# EAGLE board ESP32_Thing_Plus (EAGLE 9.3.1), part 1 of 2
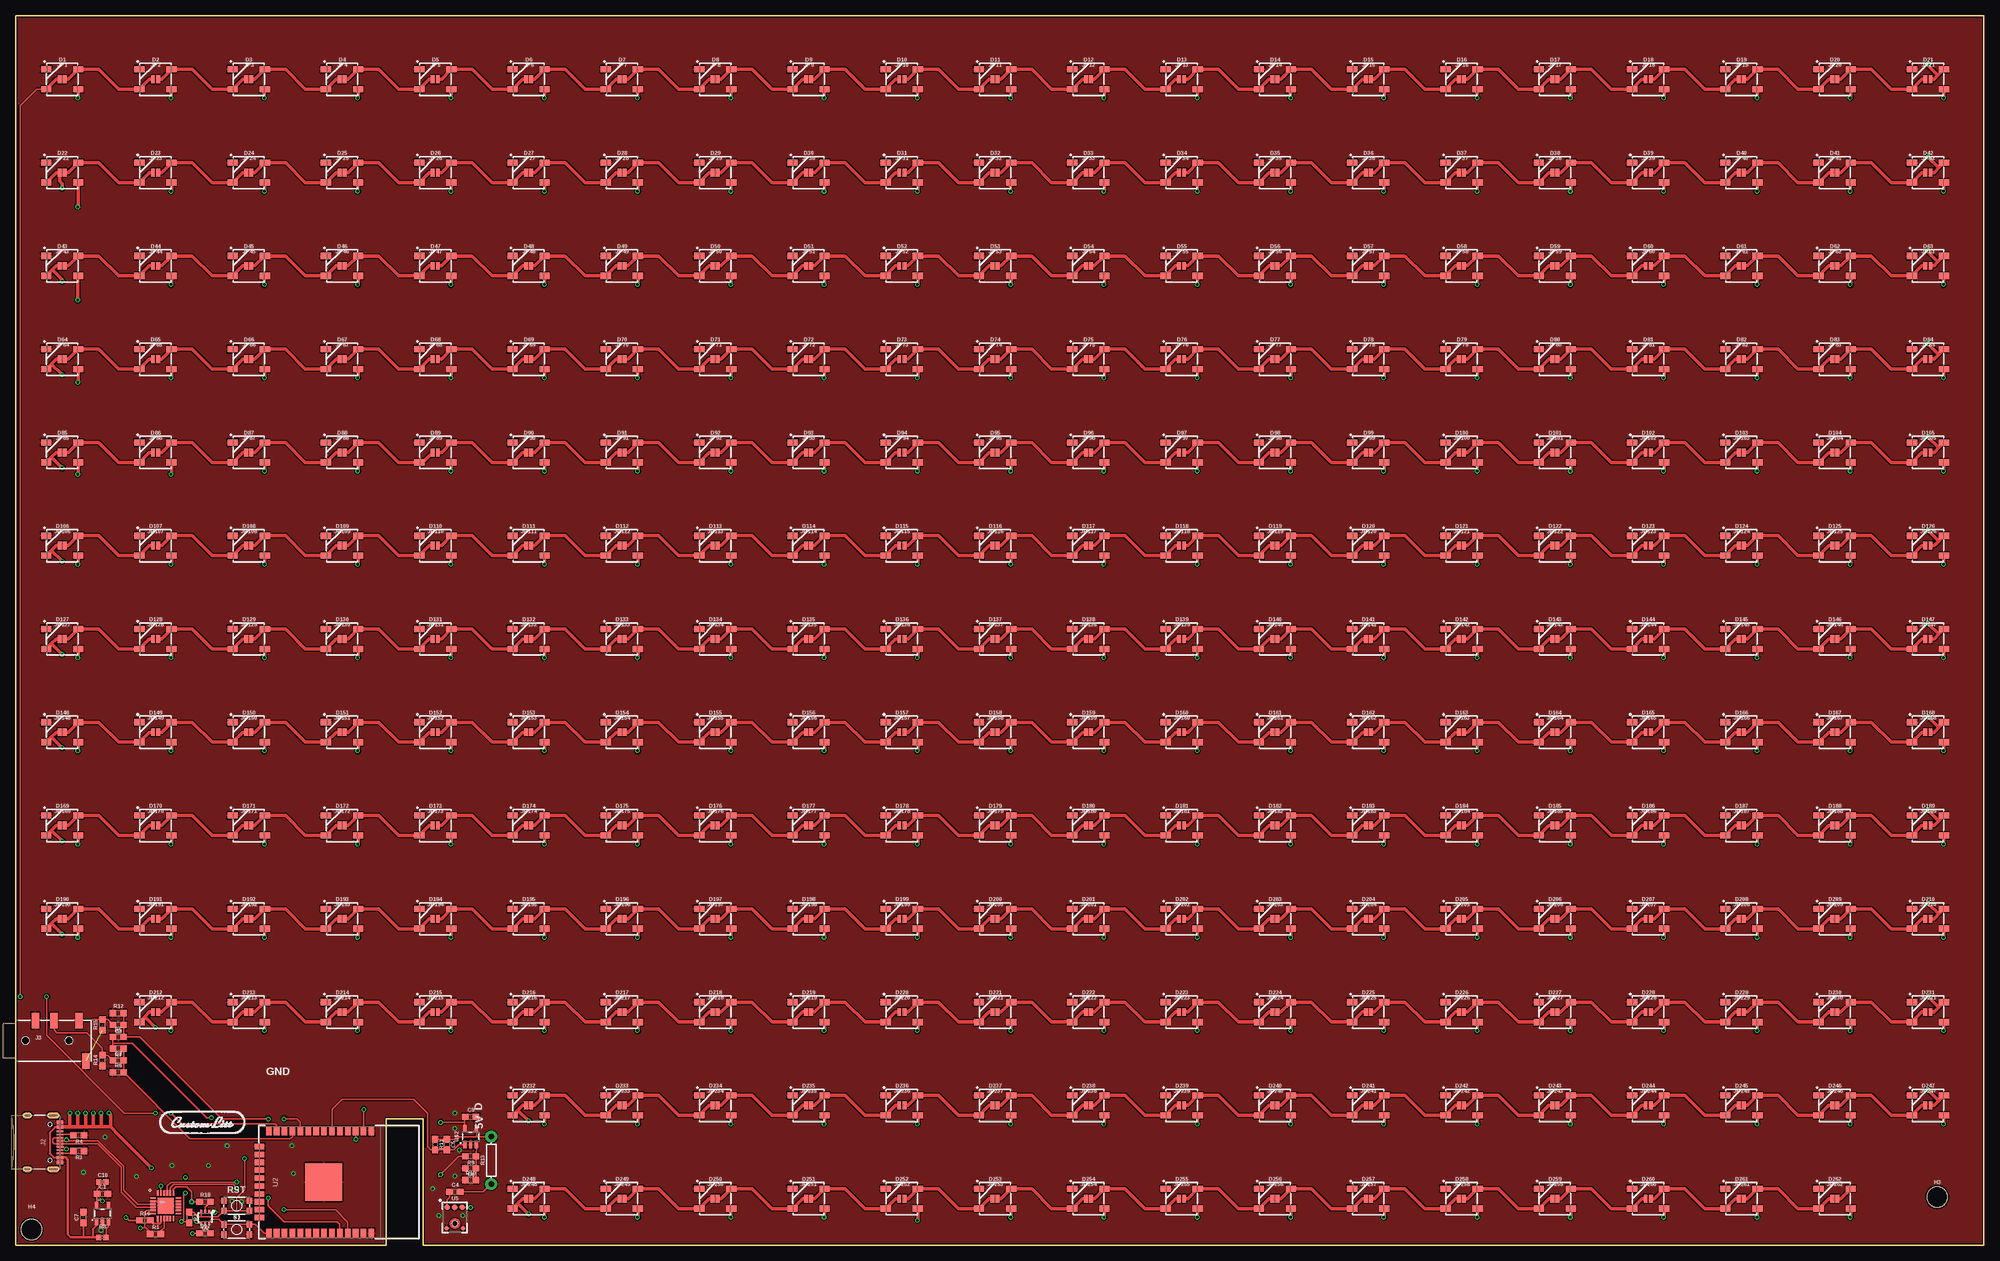
[diagram p4: board, top side]
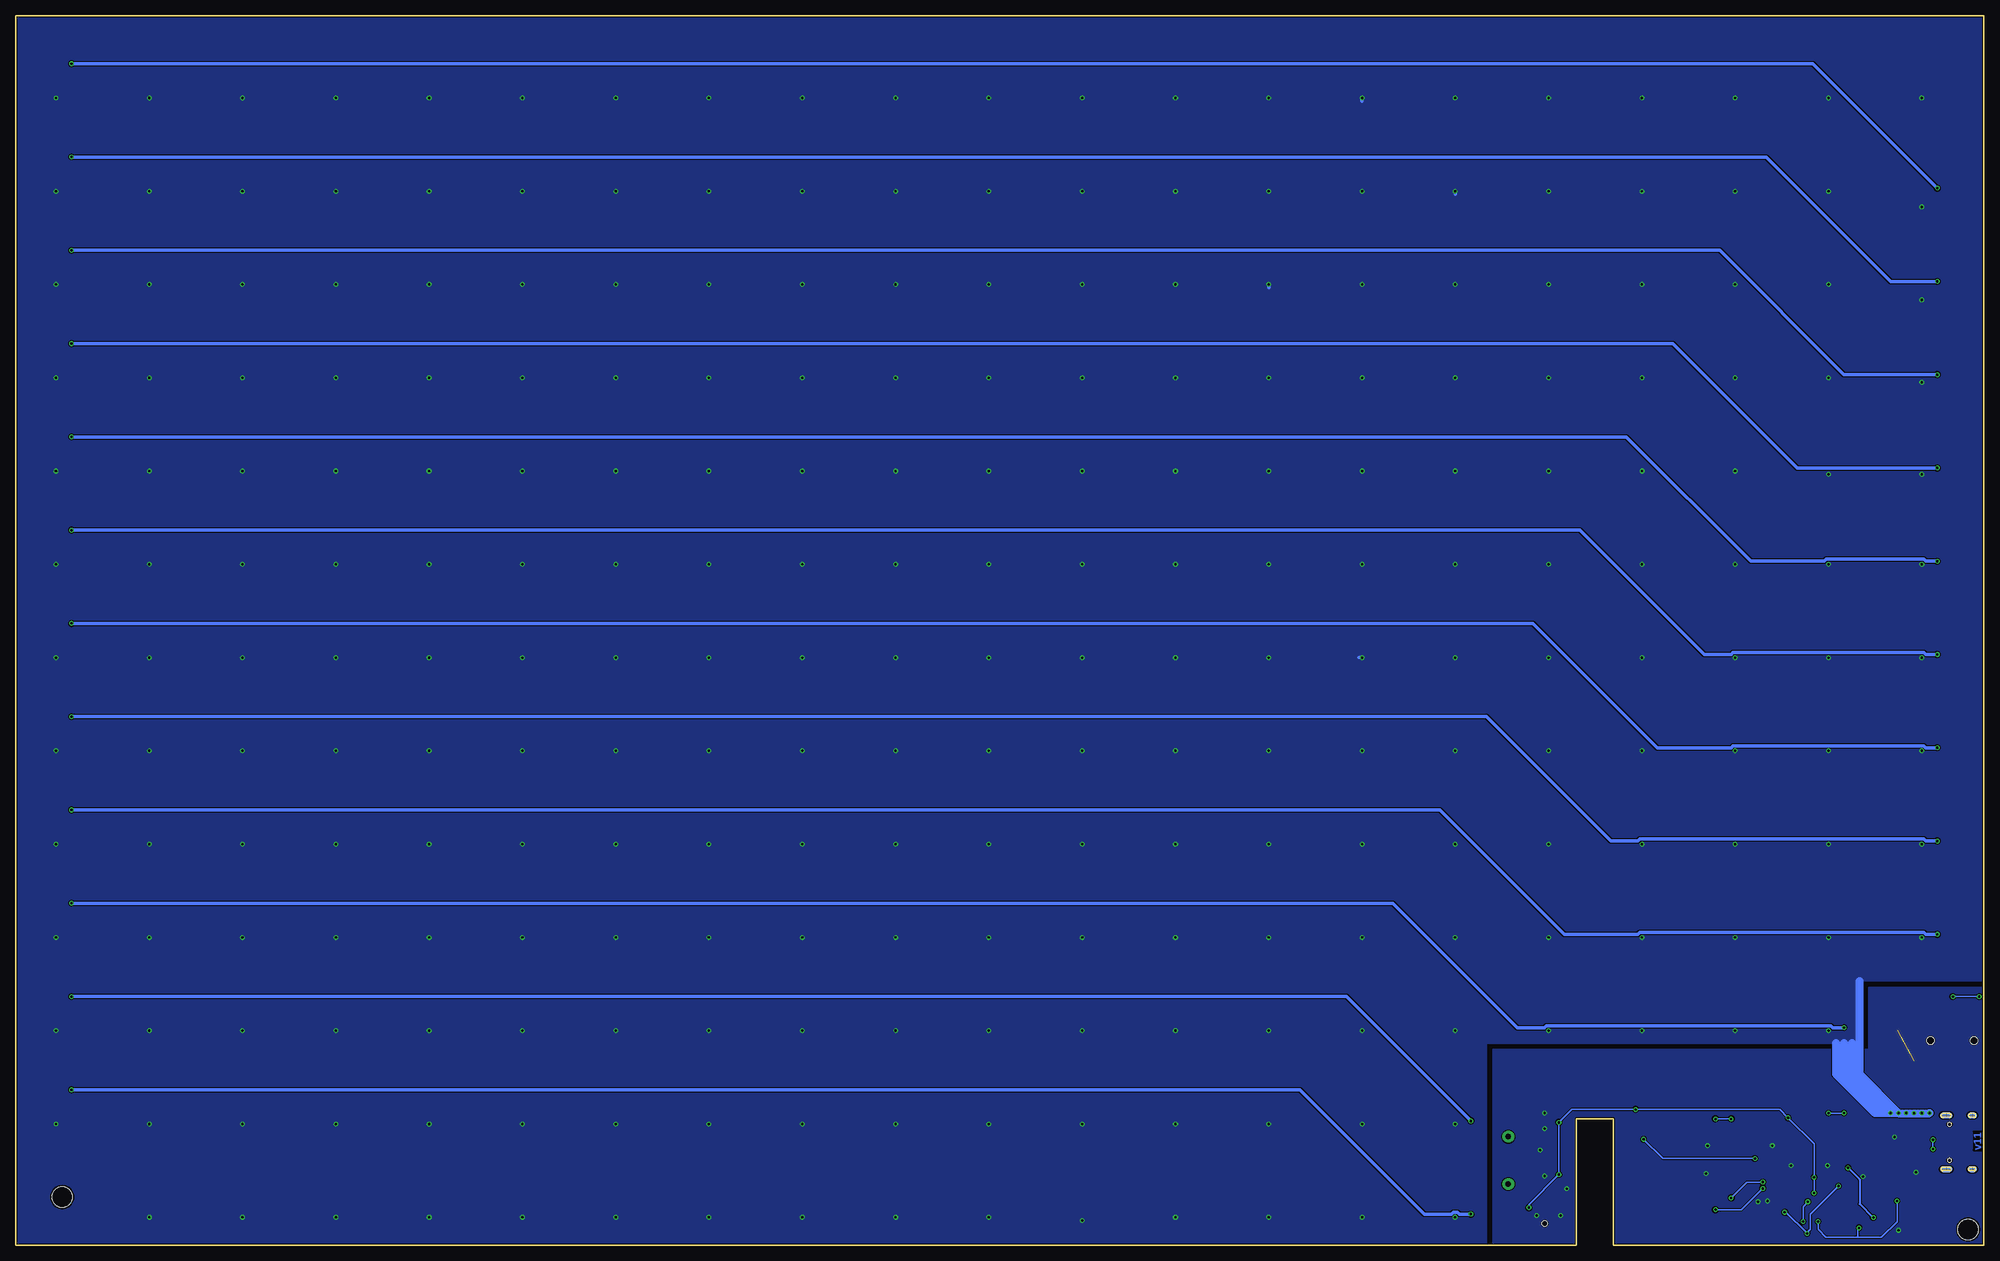
[diagram p5: board, bottom side, seen from below]

Size 316.5 x 197.75 mm. Coordinates in mm from the lower left corner, seen from the top.
Outline: 316.5,0 316.5,197.75 0,197.75 0,0 59.56,0 59.56,20.32 65.53,20.32 65.53,0 316.5,0
Copper layers (1*16): Top 0.035mm / dielectric 1.5mm / Bottom 0.035mm
Design rules "SparkFun-2-layer-TIGHT *": minimum track width 7mil, minimum drill 15mil, track to track 7mil, track to pad 7mil, pad to pad 7mil, via to via 7mil, smd to smd 7mil, copper to edge 7mil, drill to drill 7mil, minimum pad ring 7mil, minimum via ring 7mil, stop-mask expansion 4mil, vias tented up to drill 25mil, thermal gap 10mil

## Footprints (pad centres in the part's own frame; a part is rotated, then mirrored left to right if it is on the bottom)
0603 = smd 1.1 x 1: 1 -0.85,0; 2 0.85,0
0402 = smd 0.85 x 0.9: 1 -0.58,0; 2 0.58,0
WS2812B = smd 1.651 x 1: 1 2.577,-1.6; 2 2.577,1.6; 3 -2.577,1.6; 4 -2.577,-1.6
FIDUCIAL-MICRO = smd 0.635 x 0.635: 1 0,0
STAND-OFF = hole 3.302: 0,0
USB-C-16P = smd 0.3 x 1.016: A5 -1.25,0.154; A6 -0.25,0.154; A7 0.25,0.154; A8 1.25,0.154; B5 1.75,0.154; B6 0.75,0.154; B7 -0.75,0.154; B8 -1.75,0.154 | smd 0.6 x 1.016: GND -3.225,0.154; GND2 3.225,0.154 | smd 1 x 2.1: SHLD1 -4.32,-0.915; SHLD2 4.32,-0.915 | smd 1 x 2.1 bottom: SHLD3 -4.32,-0.915; SHLD4 4.32,-0.915 | smd 1 x 1.6: SHLD5 -4.32,-5.095; SHLD8 4.32,-5.095 | smd 1 x 1.6 bottom: SHLD6 -4.32,-5.095; SHLD7 4.32,-5.095 | smd 0.55 x 1.016: VBUS1 -2.45,0.154; VBUS2 2.45,0.154 | hole 0.65: -2.89,-1.445; 2.89,-1.445
AUDIO_JACK_3.5MM_TRRS_SMD_RA = smd 1.2 x 2.5: EARTH 11.3,-3.25; RING1 6.2,3.25; RING2 3.2,3.25; TIP 10.2,3.25 | hole 1.2: 1.6,0; 8.6,0
SMT-JUMPER_2_NO_NO-SILK = smd 0.635 x 1.27: 1 -0.406,0; 2 0.406,0
SC70-6 = smd 0.3 x 0.66: 1 -0.65,-0.92; 2 0,-0.92; 3 0.65,-0.92; 4 0.65,0.92; 5 0,0.92; 6 -0.65,0.92
AXIAL-0.3 = drill 0.9 pad 1.88: P$1 -3.81,0; P$2 3.81,0
TACTILE_SWITCH_SMD_4.6X2.8MM = smd 0.9 x 1: 1 -2.05,-0.8; 2 2.05,-0.8; 3 2.05,0.8; 4 -2.05,0.8
ESP-WROOM-32-NARROW = smd 0.9 x 1.5: 1 6.43,8.238; 2 5.16,8.238; 3 3.89,8.238; 4 2.62,8.238; 5 1.35,8.238; 6 0.08,8.238; 7 -1.19,8.238; 8 -2.46,8.238; 9 -3.73,8.238; 10 -5,8.238; 11 -6.27,8.238; 12 -7.54,8.238; 13 -8.81,8.238; 14 -10.08,8.238; 25 -10.08,-8.238; 26 -8.81,-8.238; 27 -7.54,-8.238; 28 -6.27,-8.238; 29 -5,-8.238; 30 -3.73,-8.238; 31 -2.46,-8.238; 32 -1.19,-8.238; 33 0.08,-8.238; 34 1.35,-8.238; 35 2.62,-8.238; 36 3.89,-8.238; 37 5.16,-8.238; 38 6.43,-8.238 | smd 1.5 x 0.9: 15 -11.57,5.715; 16 -11.57,4.445; 17 -11.57,3.175; 18 -11.57,1.905; 19 -11.57,0.635; 20 -11.57,-0.635; 21 -11.57,-1.905; 22 -11.57,-3.175; 23 -11.57,-4.445; 24 -11.57,-5.715 | smd 6 x 6: GND -1.27,0
SOT23-5 = smd 0.55 x 1.2: 1 -0.95,-1.3; 2 0,-1.3; 3 0.95,-1.3; 4 0.95,1.3; 5 -0.95,1.3
QFN24 = smd 0.85 x 0.3: 1 -2.05,1.25; 2 -2.05,0.75; 3 -2.05,0.25; 4 -2.05,-0.25; 5 -2.05,-0.75; 6 -2.05,-1.25; 13 2.05,-1.25; 14 2.05,-0.75; 15 2.05,-0.25; 16 2.05,0.25; 17 2.05,0.75; 18 2.05,1.25 | smd 0.3 x 0.85: 7 -1.25,-2.05; 8 -0.75,-2.05; 9 -0.25,-2.05; 10 0.25,-2.05; 11 0.75,-2.05; 12 1.25,-2.05; 19 1.25,2.05; 20 0.75,2.05; 21 0.25,2.05; 22 -0.25,2.05; 23 -0.75,2.05; 24 -1.25,2.05 | smd 2.55 x 2.55: PAD 0,0
ADMP401 = smd 0.9 x 0.9: 1 -1.2,2.62; 5 1.2,2.62; 6 0,2.62 | smd 0.7 x 0.7: 2 1.3,-0.8; 4 -1.3,-0.8 | hole 0.9: 0,0

## Placement (x,y rotation side)
C1  10uF  [0603]  13.97,8.26 0 top
C2  0.1uF  [0603]  16.51,29.73 0 top
C3  0.1uF  [0603]  16.51,35.44 180 top
C4  4.7uF  [0603]  70.63,8.58 0 top
C5  100pF  [0603]  69.36,16.2 270 top
C6  1.0uF  [0603]  73.17,12.39 180 top
C7  1.0uF  [0603]  10.92,4.45 90 top
C9  0.1uF  [0603]  73.17,20.64 0 top
C10  1.0uF  [0402]  13.97,10.16 0 top
D1  WS2812B  [WS2812B]  7.5,187.5 0 top
D2  WS2812B  [WS2812B]  22.5,187.5 0 top
D3  WS2812B  [WS2812B]  37.5,187.5 0 top
D4  WS2812B  [WS2812B]  52.5,187.5 0 top
D5  WS2812B  [WS2812B]  67.5,187.5 0 top
D6  WS2812B  [WS2812B]  82.5,187.5 0 top
D7  WS2812B  [WS2812B]  97.5,187.5 0 top
D8  WS2812B  [WS2812B]  112.5,187.5 0 top
D9  WS2812B  [WS2812B]  127.5,187.5 0 top
D10  WS2812B  [WS2812B]  142.5,187.5 0 top
D11  WS2812B  [WS2812B]  157.5,187.5 0 top
D12  WS2812B  [WS2812B]  172.5,187.5 0 top
D13  WS2812B  [WS2812B]  187.5,187.5 0 top
D14  WS2812B  [WS2812B]  202.5,187.5 0 top
D15  WS2812B  [WS2812B]  217.5,187.5 0 top
D16  WS2812B  [WS2812B]  232.5,187.5 0 top
D17  WS2812B  [WS2812B]  247.5,187.5 0 top
D18  WS2812B  [WS2812B]  262.5,187.5 0 top
D19  WS2812B  [WS2812B]  277.5,187.5 0 top
D20  WS2812B  [WS2812B]  292.5,187.5 0 top
D21  WS2812B  [WS2812B]  307.5,187.5 0 top
D22  WS2812B  [WS2812B]  7.5,172.5 0 top
D23  WS2812B  [WS2812B]  22.5,172.5 0 top
D24  WS2812B  [WS2812B]  37.5,172.5 0 top
D25  WS2812B  [WS2812B]  52.5,172.5 0 top
D26  WS2812B  [WS2812B]  67.5,172.5 0 top
D27  WS2812B  [WS2812B]  82.5,172.5 0 top
D28  WS2812B  [WS2812B]  97.5,172.5 0 top
D29  WS2812B  [WS2812B]  112.5,172.5 0 top
D30  WS2812B  [WS2812B]  127.5,172.5 0 top
D31  WS2812B  [WS2812B]  142.5,172.5 0 top
D32  WS2812B  [WS2812B]  157.5,172.5 0 top
D33  WS2812B  [WS2812B]  172.5,172.5 0 top
D34  WS2812B  [WS2812B]  187.5,172.5 0 top
D35  WS2812B  [WS2812B]  202.5,172.5 0 top
D36  WS2812B  [WS2812B]  217.5,172.5 0 top
D37  WS2812B  [WS2812B]  232.5,172.5 0 top
D38  WS2812B  [WS2812B]  247.5,172.5 0 top
D39  WS2812B  [WS2812B]  262.5,172.5 0 top
D40  WS2812B  [WS2812B]  277.5,172.5 0 top
D41  WS2812B  [WS2812B]  292.5,172.5 0 top
D42  WS2812B  [WS2812B]  307.5,172.5 0 top
D43  WS2812B  [WS2812B]  7.5,157.5 0 top
D44  WS2812B  [WS2812B]  22.5,157.5 0 top
D45  WS2812B  [WS2812B]  37.5,157.5 0 top
D46  WS2812B  [WS2812B]  52.5,157.5 0 top
D47  WS2812B  [WS2812B]  67.5,157.5 0 top
D48  WS2812B  [WS2812B]  82.5,157.5 0 top
D49  WS2812B  [WS2812B]  97.5,157.5 0 top
D50  WS2812B  [WS2812B]  112.5,157.5 0 top
D51  WS2812B  [WS2812B]  127.5,157.5 0 top
D52  WS2812B  [WS2812B]  142.5,157.5 0 top
D53  WS2812B  [WS2812B]  157.5,157.5 0 top
D54  WS2812B  [WS2812B]  172.5,157.5 0 top
D55  WS2812B  [WS2812B]  187.5,157.5 0 top
D56  WS2812B  [WS2812B]  202.5,157.5 0 top
D57  WS2812B  [WS2812B]  217.5,157.5 0 top
D58  WS2812B  [WS2812B]  232.5,157.5 0 top
D59  WS2812B  [WS2812B]  247.5,157.5 0 top
D60  WS2812B  [WS2812B]  262.5,157.5 0 top
D61  WS2812B  [WS2812B]  277.5,157.5 0 top
D62  WS2812B  [WS2812B]  292.5,157.5 0 top
D63  WS2812B  [WS2812B]  307.5,157.5 0 top
D64  WS2812B  [WS2812B]  7.5,142.5 0 top
D65  WS2812B  [WS2812B]  22.5,142.5 0 top
D66  WS2812B  [WS2812B]  37.5,142.5 0 top
D67  WS2812B  [WS2812B]  52.5,142.5 0 top
D68  WS2812B  [WS2812B]  67.5,142.5 0 top
D69  WS2812B  [WS2812B]  82.5,142.5 0 top
D70  WS2812B  [WS2812B]  97.5,142.5 0 top
D71  WS2812B  [WS2812B]  112.5,142.5 0 top
D72  WS2812B  [WS2812B]  127.5,142.5 0 top
D73  WS2812B  [WS2812B]  142.5,142.5 0 top
D74  WS2812B  [WS2812B]  157.5,142.5 0 top
D75  WS2812B  [WS2812B]  172.5,142.5 0 top
D76  WS2812B  [WS2812B]  187.5,142.5 0 top
D77  WS2812B  [WS2812B]  202.5,142.5 0 top
D78  WS2812B  [WS2812B]  217.5,142.5 0 top
D79  WS2812B  [WS2812B]  232.5,142.5 0 top
D80  WS2812B  [WS2812B]  247.5,142.5 0 top
D81  WS2812B  [WS2812B]  262.5,142.5 0 top
D82  WS2812B  [WS2812B]  277.5,142.5 0 top
D83  WS2812B  [WS2812B]  292.5,142.5 0 top
D84  WS2812B  [WS2812B]  307.5,142.5 0 top
D85  WS2812B  [WS2812B]  7.5,127.5 0 top
D86  WS2812B  [WS2812B]  22.5,127.5 0 top
D87  WS2812B  [WS2812B]  37.5,127.5 0 top
D88  WS2812B  [WS2812B]  52.5,127.5 0 top
D89  WS2812B  [WS2812B]  67.5,127.5 0 top
D90  WS2812B  [WS2812B]  82.5,127.5 0 top
D91  WS2812B  [WS2812B]  97.5,127.5 0 top
D92  WS2812B  [WS2812B]  112.5,127.5 0 top
D93  WS2812B  [WS2812B]  127.5,127.5 0 top
D94  WS2812B  [WS2812B]  142.5,127.5 0 top
D95  WS2812B  [WS2812B]  157.5,127.5 0 top
D96  WS2812B  [WS2812B]  172.5,127.5 0 top
D97  WS2812B  [WS2812B]  187.5,127.5 0 top
D98  WS2812B  [WS2812B]  202.5,127.5 0 top
D99  WS2812B  [WS2812B]  217.5,127.5 0 top
D100  WS2812B  [WS2812B]  232.5,127.5 0 top
D101  WS2812B  [WS2812B]  247.5,127.5 0 top
D102  WS2812B  [WS2812B]  262.5,127.5 0 top
D103  WS2812B  [WS2812B]  277.5,127.5 0 top
D104  WS2812B  [WS2812B]  292.5,127.5 0 top
D105  WS2812B  [WS2812B]  307.5,127.5 0 top
D106  WS2812B  [WS2812B]  7.5,112.5 0 top
D107  WS2812B  [WS2812B]  22.5,112.5 0 top
D108  WS2812B  [WS2812B]  37.5,112.5 0 top
D109  WS2812B  [WS2812B]  52.5,112.5 0 top
D110  WS2812B  [WS2812B]  67.5,112.5 0 top
D111  WS2812B  [WS2812B]  82.5,112.5 0 top
D112  WS2812B  [WS2812B]  97.5,112.5 0 top
D113  WS2812B  [WS2812B]  112.5,112.5 0 top
D114  WS2812B  [WS2812B]  127.5,112.5 0 top
D115  WS2812B  [WS2812B]  142.5,112.5 0 top
D116  WS2812B  [WS2812B]  157.5,112.5 0 top
D117  WS2812B  [WS2812B]  172.5,112.5 0 top
D118  WS2812B  [WS2812B]  187.5,112.5 0 top
D119  WS2812B  [WS2812B]  202.5,112.5 0 top
D120  WS2812B  [WS2812B]  217.5,112.5 0 top
D121  WS2812B  [WS2812B]  232.5,112.5 0 top
D122  WS2812B  [WS2812B]  247.5,112.5 0 top
D123  WS2812B  [WS2812B]  262.5,112.5 0 top
D124  WS2812B  [WS2812B]  277.5,112.5 0 top
D125  WS2812B  [WS2812B]  292.5,112.5 0 top
D126  WS2812B  [WS2812B]  307.5,112.5 0 top
D127  WS2812B  [WS2812B]  7.5,97.5 0 top
D128  WS2812B  [WS2812B]  22.5,97.5 0 top
D129  WS2812B  [WS2812B]  37.5,97.5 0 top
D130  WS2812B  [WS2812B]  52.5,97.5 0 top
D131  WS2812B  [WS2812B]  67.5,97.5 0 top
D132  WS2812B  [WS2812B]  82.5,97.5 0 top
D133  WS2812B  [WS2812B]  97.5,97.5 0 top
D134  WS2812B  [WS2812B]  112.5,97.5 0 top
D135  WS2812B  [WS2812B]  127.5,97.5 0 top
D136  WS2812B  [WS2812B]  142.5,97.5 0 top
D137  WS2812B  [WS2812B]  157.5,97.5 0 top
D138  WS2812B  [WS2812B]  172.5,97.5 0 top
D139  WS2812B  [WS2812B]  187.5,97.5 0 top
D140  WS2812B  [WS2812B]  202.5,97.5 0 top
D141  WS2812B  [WS2812B]  217.5,97.5 0 top
D142  WS2812B  [WS2812B]  232.5,97.5 0 top
D143  WS2812B  [WS2812B]  247.5,97.5 0 top
D144  WS2812B  [WS2812B]  262.5,97.5 0 top
D145  WS2812B  [WS2812B]  277.5,97.5 0 top
D146  WS2812B  [WS2812B]  292.5,97.5 0 top
D147  WS2812B  [WS2812B]  307.5,97.5 0 top
D148  WS2812B  [WS2812B]  7.5,82.5 0 top
D149  WS2812B  [WS2812B]  22.5,82.5 0 top
D150  WS2812B  [WS2812B]  37.5,82.5 0 top
D151  WS2812B  [WS2812B]  52.5,82.5 0 top
D152  WS2812B  [WS2812B]  67.5,82.5 0 top
D153  WS2812B  [WS2812B]  82.5,82.5 0 top
D154  WS2812B  [WS2812B]  97.5,82.5 0 top
D155  WS2812B  [WS2812B]  112.5,82.5 0 top
D156  WS2812B  [WS2812B]  127.5,82.5 0 top
D157  WS2812B  [WS2812B]  142.5,82.5 0 top
D158  WS2812B  [WS2812B]  157.5,82.5 0 top
D159  WS2812B  [WS2812B]  172.5,82.5 0 top
D160  WS2812B  [WS2812B]  187.5,82.5 0 top
D161  WS2812B  [WS2812B]  202.5,82.5 0 top
D162  WS2812B  [WS2812B]  217.5,82.5 0 top
D163  WS2812B  [WS2812B]  232.5,82.5 0 top
D164  WS2812B  [WS2812B]  247.5,82.5 0 top
D165  WS2812B  [WS2812B]  262.5,82.5 0 top
D166  WS2812B  [WS2812B]  277.5,82.5 0 top
D167  WS2812B  [WS2812B]  292.5,82.5 0 top
D168  WS2812B  [WS2812B]  307.5,82.5 0 top
D169  WS2812B  [WS2812B]  7.5,67.5 0 top
D170  WS2812B  [WS2812B]  22.5,67.5 0 top
D171  WS2812B  [WS2812B]  37.5,67.5 0 top
D172  WS2812B  [WS2812B]  52.5,67.5 0 top
D173  WS2812B  [WS2812B]  67.5,67.5 0 top
D174  WS2812B  [WS2812B]  82.5,67.5 0 top
D175  WS2812B  [WS2812B]  97.5,67.5 0 top
D176  WS2812B  [WS2812B]  112.5,67.5 0 top
D177  WS2812B  [WS2812B]  127.5,67.5 0 top
D178  WS2812B  [WS2812B]  142.5,67.5 0 top
D179  WS2812B  [WS2812B]  157.5,67.5 0 top
D180  WS2812B  [WS2812B]  172.5,67.5 0 top
D181  WS2812B  [WS2812B]  187.5,67.5 0 top
D182  WS2812B  [WS2812B]  202.5,67.5 0 top
D183  WS2812B  [WS2812B]  217.5,67.5 0 top
D184  WS2812B  [WS2812B]  232.5,67.5 0 top
D185  WS2812B  [WS2812B]  247.5,67.5 0 top
D186  WS2812B  [WS2812B]  262.5,67.5 0 top
D187  WS2812B  [WS2812B]  277.5,67.5 0 top
D188  WS2812B  [WS2812B]  292.5,67.5 0 top
D189  WS2812B  [WS2812B]  307.5,67.5 0 top
D190  WS2812B  [WS2812B]  7.5,52.5 0 top
D191  WS2812B  [WS2812B]  22.5,52.5 0 top
D192  WS2812B  [WS2812B]  37.5,52.5 0 top
D193  WS2812B  [WS2812B]  52.5,52.5 0 top
D194  WS2812B  [WS2812B]  67.5,52.5 0 top
D195  WS2812B  [WS2812B]  82.5,52.5 0 top
D196  WS2812B  [WS2812B]  97.5,52.5 0 top
D197  WS2812B  [WS2812B]  112.5,52.5 0 top
D198  WS2812B  [WS2812B]  127.5,52.5 0 top
D199  WS2812B  [WS2812B]  142.5,52.5 0 top
D200  WS2812B  [WS2812B]  157.5,52.5 0 top
D201  WS2812B  [WS2812B]  172.5,52.5 0 top
D202  WS2812B  [WS2812B]  187.5,52.5 0 top
D203  WS2812B  [WS2812B]  202.5,52.5 0 top
D204  WS2812B  [WS2812B]  217.5,52.5 0 top
D205  WS2812B  [WS2812B]  232.5,52.5 0 top
D206  WS2812B  [WS2812B]  247.5,52.5 0 top
D207  WS2812B  [WS2812B]  262.5,52.5 0 top
D208  WS2812B  [WS2812B]  277.5,52.5 0 top
D209  WS2812B  [WS2812B]  292.5,52.5 0 top
D210  WS2812B  [WS2812B]  307.5,52.5 0 top
D212  WS2812B  [WS2812B]  22.5,37.5 0 top
D213  WS2812B  [WS2812B]  37.5,37.5 0 top
D214  WS2812B  [WS2812B]  52.5,37.5 0 top
D215  WS2812B  [WS2812B]  67.5,37.5 0 top
D216  WS2812B  [WS2812B]  82.5,37.5 0 top
D217  WS2812B  [WS2812B]  97.5,37.5 0 top
D218  WS2812B  [WS2812B]  112.5,37.5 0 top
D219  WS2812B  [WS2812B]  127.5,37.5 0 top
D220  WS2812B  [WS2812B]  142.5,37.5 0 top
D221  WS2812B  [WS2812B]  157.5,37.5 0 top
D222  WS2812B  [WS2812B]  172.5,37.5 0 top
D223  WS2812B  [WS2812B]  187.5,37.5 0 top
D224  WS2812B  [WS2812B]  202.5,37.5 0 top
D225  WS2812B  [WS2812B]  217.5,37.5 0 top
D226  WS2812B  [WS2812B]  232.5,37.5 0 top
D227  WS2812B  [WS2812B]  247.5,37.5 0 top
D228  WS2812B  [WS2812B]  262.5,37.5 0 top
D229  WS2812B  [WS2812B]  277.5,37.5 0 top
D230  WS2812B  [WS2812B]  292.5,37.5 0 top
D231  WS2812B  [WS2812B]  307.5,37.5 0 top
D232  WS2812B  [WS2812B]  82.5,22.5 0 top
D233  WS2812B  [WS2812B]  97.5,22.5 0 top
D234  WS2812B  [WS2812B]  112.5,22.5 0 top
D235  WS2812B  [WS2812B]  127.5,22.5 0 top
D236  WS2812B  [WS2812B]  142.5,22.5 0 top
D237  WS2812B  [WS2812B]  157.5,22.5 0 top
D238  WS2812B  [WS2812B]  172.5,22.5 0 top
D239  WS2812B  [WS2812B]  187.5,22.5 0 top
D240  WS2812B  [WS2812B]  202.5,22.5 0 top
D241  WS2812B  [WS2812B]  217.5,22.5 0 top
D242  WS2812B  [WS2812B]  232.5,22.5 0 top
D243  WS2812B  [WS2812B]  247.5,22.5 0 top
D244  WS2812B  [WS2812B]  262.5,22.5 0 top
D245  WS2812B  [WS2812B]  277.5,22.5 0 top
D246  WS2812B  [WS2812B]  292.5,22.5 0 top
D247  WS2812B  [WS2812B]  307.5,22.5 0 top
D248  WS2812B  [WS2812B]  82.5,7.5 0 top
D249  WS2812B  [WS2812B]  97.5,7.5 0 top
D250  WS2812B  [WS2812B]  112.5,7.5 0 top
D251  WS2812B  [WS2812B]  127.5,7.5 0 top
D252  WS2812B  [WS2812B]  142.5,7.5 0 top
D253  WS2812B  [WS2812B]  157.5,7.5 0 top
D254  WS2812B  [WS2812B]  172.5,7.5 0 top
D255  WS2812B  [WS2812B]  187.5,7.5 0 top
D256  WS2812B  [WS2812B]  202.5,7.5 0 top
D257  WS2812B  [WS2812B]  217.5,7.5 0 top
D258  WS2812B  [WS2812B]  232.5,7.5 0 top
D259  WS2812B  [WS2812B]  247.5,7.5 0 top
D260  WS2812B  [WS2812B]  262.5,7.5 0 top
D261  WS2812B  [WS2812B]  277.5,7.5 0 top
D262  WS2812B  [WS2812B]  292.5,7.5 0 top
FD1  FIDUCIALUFIDUCIAL  [FIDUCIAL-MICRO]  -45.72,48.26 0 top  (outside the outline)
FD2  FIDUCIALUFIDUCIAL  [FIDUCIAL-MICRO]  -48.26,48.26 0 top  (outside the outline)
FD3  FIDUCIALUFIDUCIAL  [FIDUCIAL-MICRO]  -50.8,48.26 0 top  (outside the outline)
FD4  FIDUCIALUFIDUCIAL  [FIDUCIAL-MICRO]  -53.34,48.26 0 top  (outside the outline)
FRAME1  FRAME-LEDGER  [CREATIVE_COMMONS]  7.62,-8.89 0 top  (outside the outline)
FRAME2  FRAME-LEDGER  [CREATIVE_COMMONS]  135,-15 0 top  (outside the outline)
FRAME3  FRAME-LEDGER  [CREATIVE_COMMONS]  135,-15 0 top  (outside the outline)
FRAME4  FRAME-LEDGER  [CREATIVE_COMMONS]  135,-15 0 top  (outside the outline)
H3  STAND-OFF  [STAND-OFF]  309,7.75 0 top
H4  STAND-OFF  [STAND-OFF]  2.54,2.54 0 top
J2  USB Female Type C Connector  [USB-C-16P]  6.99,16.56 270 top
J3  AUDIO_JACK_TRRSSMD_RA  [AUDIO_JACK_3.5MM_TRRS_SMD_RA]  0,32.9 0 top
JP1  JUMPER-SMT_2_NO_NO-SILK  [SMT-JUMPER_2_NO_NO-SILK]  7.5,187.5 0 top
JP2  JUMPER-SMT_2_NO_NO-SILK  [SMT-JUMPER_2_NO_NO-SILK]  22.5,187.5 0 top
JP3  JUMPER-SMT_2_NO_NO-SILK  [SMT-JUMPER_2_NO_NO-SILK]  37.5,187.5 0 top
JP4  JUMPER-SMT_2_NO_NO-SILK  [SMT-JUMPER_2_NO_NO-SILK]  52.5,187.5 0 top
JP5  JUMPER-SMT_2_NO_NO-SILK  [SMT-JUMPER_2_NO_NO-SILK]  67.5,187.5 0 top
JP6  JUMPER-SMT_2_NO_NO-SILK  [SMT-JUMPER_2_NO_NO-SILK]  82.5,187.5 0 top
JP7  JUMPER-SMT_2_NO_NO-SILK  [SMT-JUMPER_2_NO_NO-SILK]  97.5,187.5 0 top
JP8  JUMPER-SMT_2_NO_NO-SILK  [SMT-JUMPER_2_NO_NO-SILK]  112.5,187.5 0 top
JP9  JUMPER-SMT_2_NO_NO-SILK  [SMT-JUMPER_2_NO_NO-SILK]  127.5,187.5 0 top
JP10  JUMPER-SMT_2_NO_NO-SILK  [SMT-JUMPER_2_NO_NO-SILK]  142.5,187.5 0 top
JP11  JUMPER-SMT_2_NO_NO-SILK  [SMT-JUMPER_2_NO_NO-SILK]  157.5,187.5 0 top
JP12  JUMPER-SMT_2_NO_NO-SILK  [SMT-JUMPER_2_NO_NO-SILK]  172.5,187.5 0 top
JP13  JUMPER-SMT_2_NO_NO-SILK  [SMT-JUMPER_2_NO_NO-SILK]  187.5,187.5 0 top
JP14  JUMPER-SMT_2_NO_NO-SILK  [SMT-JUMPER_2_NO_NO-SILK]  202.5,187.5 0 top
JP15  JUMPER-SMT_2_NO_NO-SILK  [SMT-JUMPER_2_NO_NO-SILK]  217.5,187.5 0 top
JP16  JUMPER-SMT_2_NO_NO-SILK  [SMT-JUMPER_2_NO_NO-SILK]  232.5,187.5 0 top
JP17  JUMPER-SMT_2_NO_NO-SILK  [SMT-JUMPER_2_NO_NO-SILK]  247.5,187.5 0 top
JP18  JUMPER-SMT_2_NO_NO-SILK  [SMT-JUMPER_2_NO_NO-SILK]  262.5,187.5 0 top
JP19  JUMPER-SMT_2_NO_NO-SILK  [SMT-JUMPER_2_NO_NO-SILK]  277.5,187.5 0 top
JP20  JUMPER-SMT_2_NO_NO-SILK  [SMT-JUMPER_2_NO_NO-SILK]  292.5,187.5 0 top
JP21  JUMPER-SMT_2_NO_NO-SILK  [SMT-JUMPER_2_NO_NO-SILK]  307.5,187.5 0 top
JP22  JUMPER-SMT_2_NO_NO-SILK  [SMT-JUMPER_2_NO_NO-SILK]  7.5,172.5 0 top
JP23  JUMPER-SMT_2_NO_NO-SILK  [SMT-JUMPER_2_NO_NO-SILK]  22.5,172.5 0 top
JP24  JUMPER-SMT_2_NO_NO-SILK  [SMT-JUMPER_2_NO_NO-SILK]  37.5,172.5 0 top
JP25  JUMPER-SMT_2_NO_NO-SILK  [SMT-JUMPER_2_NO_NO-SILK]  52.5,172.5 0 top
JP26  JUMPER-SMT_2_NO_NO-SILK  [SMT-JUMPER_2_NO_NO-SILK]  67.5,172.5 0 top
JP27  JUMPER-SMT_2_NO_NO-SILK  [SMT-JUMPER_2_NO_NO-SILK]  82.5,172.5 0 top
JP28  JUMPER-SMT_2_NO_NO-SILK  [SMT-JUMPER_2_NO_NO-SILK]  97.5,172.5 0 top
JP29  JUMPER-SMT_2_NO_NO-SILK  [SMT-JUMPER_2_NO_NO-SILK]  112.5,172.5 0 top
JP30  JUMPER-SMT_2_NO_NO-SILK  [SMT-JUMPER_2_NO_NO-SILK]  127.5,172.5 0 top
JP31  JUMPER-SMT_2_NO_NO-SILK  [SMT-JUMPER_2_NO_NO-SILK]  142.5,172.5 0 top
JP32  JUMPER-SMT_2_NO_NO-SILK  [SMT-JUMPER_2_NO_NO-SILK]  157.5,172.5 0 top
JP33  JUMPER-SMT_2_NO_NO-SILK  [SMT-JUMPER_2_NO_NO-SILK]  172.5,172.5 0 top
JP34  JUMPER-SMT_2_NO_NO-SILK  [SMT-JUMPER_2_NO_NO-SILK]  187.5,172.5 0 top
JP35  JUMPER-SMT_2_NO_NO-SILK  [SMT-JUMPER_2_NO_NO-SILK]  202.5,172.5 0 top
JP36  JUMPER-SMT_2_NO_NO-SILK  [SMT-JUMPER_2_NO_NO-SILK]  217.5,172.5 0 top
JP37  JUMPER-SMT_2_NO_NO-SILK  [SMT-JUMPER_2_NO_NO-SILK]  232.5,172.5 0 top
JP38  JUMPER-SMT_2_NO_NO-SILK  [SMT-JUMPER_2_NO_NO-SILK]  247.5,172.5 0 top
JP39  JUMPER-SMT_2_NO_NO-SILK  [SMT-JUMPER_2_NO_NO-SILK]  262.5,172.5 0 top
JP40  JUMPER-SMT_2_NO_NO-SILK  [SMT-JUMPER_2_NO_NO-SILK]  277.5,172.5 0 top
JP41  JUMPER-SMT_2_NO_NO-SILK  [SMT-JUMPER_2_NO_NO-SILK]  292.5,172.5 0 top
JP42  JUMPER-SMT_2_NO_NO-SILK  [SMT-JUMPER_2_NO_NO-SILK]  307.5,172.5 0 top
JP43  JUMPER-SMT_2_NO_NO-SILK  [SMT-JUMPER_2_NO_NO-SILK]  7.5,157.5 0 top
JP44  JUMPER-SMT_2_NO_NO-SILK  [SMT-JUMPER_2_NO_NO-SILK]  22.5,157.5 0 top
JP45  JUMPER-SMT_2_NO_NO-SILK  [SMT-JUMPER_2_NO_NO-SILK]  37.5,157.5 0 top
JP46  JUMPER-SMT_2_NO_NO-SILK  [SMT-JUMPER_2_NO_NO-SILK]  52.5,157.5 0 top
JP47  JUMPER-SMT_2_NO_NO-SILK  [SMT-JUMPER_2_NO_NO-SILK]  67.5,157.5 0 top
JP48  JUMPER-SMT_2_NO_NO-SILK  [SMT-JUMPER_2_NO_NO-SILK]  82.5,157.5 0 top
JP49  JUMPER-SMT_2_NO_NO-SILK  [SMT-JUMPER_2_NO_NO-SILK]  97.5,157.5 0 top
JP50  JUMPER-SMT_2_NO_NO-SILK  [SMT-JUMPER_2_NO_NO-SILK]  112.5,157.5 0 top
JP51  JUMPER-SMT_2_NO_NO-SILK  [SMT-JUMPER_2_NO_NO-SILK]  127.5,157.5 0 top
JP52  JUMPER-SMT_2_NO_NO-SILK  [SMT-JUMPER_2_NO_NO-SILK]  142.5,157.5 0 top
JP53  JUMPER-SMT_2_NO_NO-SILK  [SMT-JUMPER_2_NO_NO-SILK]  157.5,157.5 0 top
JP54  JUMPER-SMT_2_NO_NO-SILK  [SMT-JUMPER_2_NO_NO-SILK]  172.5,157.5 0 top
JP55  JUMPER-SMT_2_NO_NO-SILK  [SMT-JUMPER_2_NO_NO-SILK]  187.5,157.5 0 top
JP56  JUMPER-SMT_2_NO_NO-SILK  [SMT-JUMPER_2_NO_NO-SILK]  202.5,157.5 0 top
JP57  JUMPER-SMT_2_NO_NO-SILK  [SMT-JUMPER_2_NO_NO-SILK]  217.5,157.5 0 top
JP58  JUMPER-SMT_2_NO_NO-SILK  [SMT-JUMPER_2_NO_NO-SILK]  232.5,157.5 0 top
JP59  JUMPER-SMT_2_NO_NO-SILK  [SMT-JUMPER_2_NO_NO-SILK]  247.5,157.5 0 top
JP60  JUMPER-SMT_2_NO_NO-SILK  [SMT-JUMPER_2_NO_NO-SILK]  262.5,157.5 0 top
JP61  JUMPER-SMT_2_NO_NO-SILK  [SMT-JUMPER_2_NO_NO-SILK]  277.5,157.5 0 top
JP62  JUMPER-SMT_2_NO_NO-SILK  [SMT-JUMPER_2_NO_NO-SILK]  292.5,157.5 0 top
JP63  JUMPER-SMT_2_NO_NO-SILK  [SMT-JUMPER_2_NO_NO-SILK]  307.5,157.5 0 top
JP64  JUMPER-SMT_2_NO_NO-SILK  [SMT-JUMPER_2_NO_NO-SILK]  7.5,142.5 0 top
JP65  JUMPER-SMT_2_NO_NO-SILK  [SMT-JUMPER_2_NO_NO-SILK]  22.5,142.5 0 top
JP66  JUMPER-SMT_2_NO_NO-SILK  [SMT-JUMPER_2_NO_NO-SILK]  37.5,142.5 0 top
JP67  JUMPER-SMT_2_NO_NO-SILK  [SMT-JUMPER_2_NO_NO-SILK]  52.5,142.5 0 top
JP68  JUMPER-SMT_2_NO_NO-SILK  [SMT-JUMPER_2_NO_NO-SILK]  67.5,142.5 0 top
JP69  JUMPER-SMT_2_NO_NO-SILK  [SMT-JUMPER_2_NO_NO-SILK]  82.5,142.5 0 top
JP70  JUMPER-SMT_2_NO_NO-SILK  [SMT-JUMPER_2_NO_NO-SILK]  97.5,142.5 0 top
JP71  JUMPER-SMT_2_NO_NO-SILK  [SMT-JUMPER_2_NO_NO-SILK]  112.5,142.5 0 top
JP72  JUMPER-SMT_2_NO_NO-SILK  [SMT-JUMPER_2_NO_NO-SILK]  127.5,142.5 0 top
JP73  JUMPER-SMT_2_NO_NO-SILK  [SMT-JUMPER_2_NO_NO-SILK]  142.5,142.5 0 top
JP74  JUMPER-SMT_2_NO_NO-SILK  [SMT-JUMPER_2_NO_NO-SILK]  157.5,142.5 0 top
JP75  JUMPER-SMT_2_NO_NO-SILK  [SMT-JUMPER_2_NO_NO-SILK]  172.5,142.5 0 top
JP76  JUMPER-SMT_2_NO_NO-SILK  [SMT-JUMPER_2_NO_NO-SILK]  187.5,142.5 0 top
JP77  JUMPER-SMT_2_NO_NO-SILK  [SMT-JUMPER_2_NO_NO-SILK]  202.5,142.5 0 top
JP78  JUMPER-SMT_2_NO_NO-SILK  [SMT-JUMPER_2_NO_NO-SILK]  217.5,142.5 0 top
JP79  JUMPER-SMT_2_NO_NO-SILK  [SMT-JUMPER_2_NO_NO-SILK]  232.5,142.5 0 top
JP80  JUMPER-SMT_2_NO_NO-SILK  [SMT-JUMPER_2_NO_NO-SILK]  247.5,142.5 0 top
JP81  JUMPER-SMT_2_NO_NO-SILK  [SMT-JUMPER_2_NO_NO-SILK]  262.5,142.5 0 top
JP82  JUMPER-SMT_2_NO_NO-SILK  [SMT-JUMPER_2_NO_NO-SILK]  277.5,142.5 0 top
JP83  JUMPER-SMT_2_NO_NO-SILK  [SMT-JUMPER_2_NO_NO-SILK]  292.5,142.5 0 top
JP84  JUMPER-SMT_2_NO_NO-SILK  [SMT-JUMPER_2_NO_NO-SILK]  307.5,142.5 0 top
JP85  JUMPER-SMT_2_NO_NO-SILK  [SMT-JUMPER_2_NO_NO-SILK]  7.5,127.5 0 top
JP86  JUMPER-SMT_2_NO_NO-SILK  [SMT-JUMPER_2_NO_NO-SILK]  22.5,127.5 0 top
JP87  JUMPER-SMT_2_NO_NO-SILK  [SMT-JUMPER_2_NO_NO-SILK]  37.5,127.5 0 top
JP88  JUMPER-SMT_2_NO_NO-SILK  [SMT-JUMPER_2_NO_NO-SILK]  52.5,127.5 0 top
JP89  JUMPER-SMT_2_NO_NO-SILK  [SMT-JUMPER_2_NO_NO-SILK]  67.5,127.5 0 top
JP90  JUMPER-SMT_2_NO_NO-SILK  [SMT-JUMPER_2_NO_NO-SILK]  82.5,127.5 0 top
JP91  JUMPER-SMT_2_NO_NO-SILK  [SMT-JUMPER_2_NO_NO-SILK]  97.5,127.5 0 top
JP92  JUMPER-SMT_2_NO_NO-SILK  [SMT-JUMPER_2_NO_NO-SILK]  112.5,127.5 0 top
JP93  JUMPER-SMT_2_NO_NO-SILK  [SMT-JUMPER_2_NO_NO-SILK]  127.5,127.5 0 top
JP94  JUMPER-SMT_2_NO_NO-SILK  [SMT-JUMPER_2_NO_NO-SILK]  142.5,127.5 0 top
JP95  JUMPER-SMT_2_NO_NO-SILK  [SMT-JUMPER_2_NO_NO-SILK]  157.5,127.5 0 top
JP96  JUMPER-SMT_2_NO_NO-SILK  [SMT-JUMPER_2_NO_NO-SILK]  172.5,127.5 0 top
JP97  JUMPER-SMT_2_NO_NO-SILK  [SMT-JUMPER_2_NO_NO-SILK]  187.5,127.5 0 top
JP98  JUMPER-SMT_2_NO_NO-SILK  [SMT-JUMPER_2_NO_NO-SILK]  202.5,127.5 0 top
JP99  JUMPER-SMT_2_NO_NO-SILK  [SMT-JUMPER_2_NO_NO-SILK]  217.5,127.5 0 top
JP100  JUMPER-SMT_2_NO_NO-SILK  [SMT-JUMPER_2_NO_NO-SILK]  232.5,127.5 0 top
JP101  JUMPER-SMT_2_NO_NO-SILK  [SMT-JUMPER_2_NO_NO-SILK]  247.5,127.5 0 top
JP102  JUMPER-SMT_2_NO_NO-SILK  [SMT-JUMPER_2_NO_NO-SILK]  262.5,127.5 0 top
JP103  JUMPER-SMT_2_NO_NO-SILK  [SMT-JUMPER_2_NO_NO-SILK]  277.5,127.5 0 top
JP104  JUMPER-SMT_2_NO_NO-SILK  [SMT-JUMPER_2_NO_NO-SILK]  292.5,127.5 0 top
JP105  JUMPER-SMT_2_NO_NO-SILK  [SMT-JUMPER_2_NO_NO-SILK]  307.5,127.5 0 top
JP106  JUMPER-SMT_2_NO_NO-SILK  [SMT-JUMPER_2_NO_NO-SILK]  7.5,112.5 0 top
JP107  JUMPER-SMT_2_NO_NO-SILK  [SMT-JUMPER_2_NO_NO-SILK]  22.5,112.5 0 top
JP108  JUMPER-SMT_2_NO_NO-SILK  [SMT-JUMPER_2_NO_NO-SILK]  37.5,112.5 0 top
JP109  JUMPER-SMT_2_NO_NO-SILK  [SMT-JUMPER_2_NO_NO-SILK]  52.5,112.5 0 top
JP110  JUMPER-SMT_2_NO_NO-SILK  [SMT-JUMPER_2_NO_NO-SILK]  67.5,112.5 0 top
JP111  JUMPER-SMT_2_NO_NO-SILK  [SMT-JUMPER_2_NO_NO-SILK]  82.5,112.5 0 top
JP112  JUMPER-SMT_2_NO_NO-SILK  [SMT-JUMPER_2_NO_NO-SILK]  97.5,112.5 0 top
JP113  JUMPER-SMT_2_NO_NO-SILK  [SMT-JUMPER_2_NO_NO-SILK]  112.5,112.5 0 top
JP114  JUMPER-SMT_2_NO_NO-SILK  [SMT-JUMPER_2_NO_NO-SILK]  127.5,112.5 0 top
JP115  JUMPER-SMT_2_NO_NO-SILK  [SMT-JUMPER_2_NO_NO-SILK]  142.5,112.5 0 top
JP116  JUMPER-SMT_2_NO_NO-SILK  [SMT-JUMPER_2_NO_NO-SILK]  157.5,112.5 0 top
JP117  JUMPER-SMT_2_NO_NO-SILK  [SMT-JUMPER_2_NO_NO-SILK]  172.5,112.5 0 top
JP118  JUMPER-SMT_2_NO_NO-SILK  [SMT-JUMPER_2_NO_NO-SILK]  187.5,112.5 0 top
JP119  JUMPER-SMT_2_NO_NO-SILK  [SMT-JUMPER_2_NO_NO-SILK]  202.5,112.5 0 top
JP120  JUMPER-SMT_2_NO_NO-SILK  [SMT-JUMPER_2_NO_NO-SILK]  217.5,112.5 0 top
JP121  JUMPER-SMT_2_NO_NO-SILK  [SMT-JUMPER_2_NO_NO-SILK]  232.5,112.5 0 top
JP122  JUMPER-SMT_2_NO_NO-SILK  [SMT-JUMPER_2_NO_NO-SILK]  247.5,112.5 0 top
JP123  JUMPER-SMT_2_NO_NO-SILK  [SMT-JUMPER_2_NO_NO-SILK]  262.5,112.5 0 top
JP124  JUMPER-SMT_2_NO_NO-SILK  [SMT-JUMPER_2_NO_NO-SILK]  277.5,112.5 0 top
JP125  JUMPER-SMT_2_NO_NO-SILK  [SMT-JUMPER_2_NO_NO-SILK]  292.5,112.5 0 top
JP126  JUMPER-SMT_2_NO_NO-SILK  [SMT-JUMPER_2_NO_NO-SILK]  307.5,112.5 0 top
JP127  JUMPER-SMT_2_NO_NO-SILK  [SMT-JUMPER_2_NO_NO-SILK]  7.5,97.5 0 top
JP128  JUMPER-SMT_2_NO_NO-SILK  [SMT-JUMPER_2_NO_NO-SILK]  22.5,97.5 0 top
JP129  JUMPER-SMT_2_NO_NO-SILK  [SMT-JUMPER_2_NO_NO-SILK]  37.5,97.5 0 top
JP130  JUMPER-SMT_2_NO_NO-SILK  [SMT-JUMPER_2_NO_NO-SILK]  52.5,97.5 0 top
JP131  JUMPER-SMT_2_NO_NO-SILK  [SMT-JUMPER_2_NO_NO-SILK]  67.5,97.5 0 top
JP132  JUMPER-SMT_2_NO_NO-SILK  [SMT-JUMPER_2_NO_NO-SILK]  82.5,97.5 0 top
JP133  JUMPER-SMT_2_NO_NO-SILK  [SMT-JUMPER_2_NO_NO-SILK]  97.5,97.5 0 top
JP134  JUMPER-SMT_2_NO_NO-SILK  [SMT-JUMPER_2_NO_NO-SILK]  112.5,97.5 0 top
JP135  JUMPER-SMT_2_NO_NO-SILK  [SMT-JUMPER_2_NO_NO-SILK]  127.5,97.5 0 top
JP136  JUMPER-SMT_2_NO_NO-SILK  [SMT-JUMPER_2_NO_NO-SILK]  142.5,97.5 0 top
JP137  JUMPER-SMT_2_NO_NO-SILK  [SMT-JUMPER_2_NO_NO-SILK]  157.5,97.5 0 top
JP138  JUMPER-SMT_2_NO_NO-SILK  [SMT-JUMPER_2_NO_NO-SILK]  172.5,97.5 0 top
JP139  JUMPER-SMT_2_NO_NO-SILK  [SMT-JUMPER_2_NO_NO-SILK]  187.5,97.5 0 top
JP140  JUMPER-SMT_2_NO_NO-SILK  [SMT-JUMPER_2_NO_NO-SILK]  202.5,97.5 0 top
JP141  JUMPER-SMT_2_NO_NO-SILK  [SMT-JUMPER_2_NO_NO-SILK]  217.5,97.5 0 top
JP142  JUMPER-SMT_2_NO_NO-SILK  [SMT-JUMPER_2_NO_NO-SILK]  232.5,97.5 0 top
JP143  JUMPER-SMT_2_NO_NO-SILK  [SMT-JUMPER_2_NO_NO-SILK]  247.5,97.5 0 top
JP144  JUMPER-SMT_2_NO_NO-SILK  [SMT-JUMPER_2_NO_NO-SILK]  262.5,97.5 0 top
JP145  JUMPER-SMT_2_NO_NO-SILK  [SMT-JUMPER_2_NO_NO-SILK]  277.5,97.5 0 top
JP146  JUMPER-SMT_2_NO_NO-SILK  [SMT-JUMPER_2_NO_NO-SILK]  292.5,97.5 0 top
JP147  JUMPER-SMT_2_NO_NO-SILK  [SMT-JUMPER_2_NO_NO-SILK]  307.5,97.5 0 top
JP148  JUMPER-SMT_2_NO_NO-SILK  [SMT-JUMPER_2_NO_NO-SILK]  7.5,82.5 0 top
JP149  JUMPER-SMT_2_NO_NO-SILK  [SMT-JUMPER_2_NO_NO-SILK]  22.5,82.5 0 top
JP150  JUMPER-SMT_2_NO_NO-SILK  [SMT-JUMPER_2_NO_NO-SILK]  37.5,82.5 0 top
JP151  JUMPER-SMT_2_NO_NO-SILK  [SMT-JUMPER_2_NO_NO-SILK]  52.5,82.5 0 top
JP152  JUMPER-SMT_2_NO_NO-SILK  [SMT-JUMPER_2_NO_NO-SILK]  67.5,82.5 0 top
JP153  JUMPER-SMT_2_NO_NO-SILK  [SMT-JUMPER_2_NO_NO-SILK]  82.5,82.5 0 top
JP154  JUMPER-SMT_2_NO_NO-SILK  [SMT-JUMPER_2_NO_NO-SILK]  97.5,82.5 0 top
JP155  JUMPER-SMT_2_NO_NO-SILK  [SMT-JUMPER_2_NO_NO-SILK]  112.5,82.5 0 top
JP156  JUMPER-SMT_2_NO_NO-SILK  [SMT-JUMPER_2_NO_NO-SILK]  127.5,82.5 0 top
JP157  JUMPER-SMT_2_NO_NO-SILK  [SMT-JUMPER_2_NO_NO-SILK]  142.5,82.5 0 top
JP158  JUMPER-SMT_2_NO_NO-SILK  [SMT-JUMPER_2_NO_NO-SILK]  157.5,82.5 0 top
JP159  JUMPER-SMT_2_NO_NO-SILK  [SMT-JUMPER_2_NO_NO-SILK]  172.5,82.5 0 top
JP160  JUMPER-SMT_2_NO_NO-SILK  [SMT-JUMPER_2_NO_NO-SILK]  187.5,82.5 0 top
JP161  JUMPER-SMT_2_NO_NO-SILK  [SMT-JUMPER_2_NO_NO-SILK]  202.5,82.5 0 top
JP162  JUMPER-SMT_2_NO_NO-SILK  [SMT-JUMPER_2_NO_NO-SILK]  217.5,82.5 0 top
JP163  JUMPER-SMT_2_NO_NO-SILK  [SMT-JUMPER_2_NO_NO-SILK]  232.5,82.5 0 top
JP164  JUMPER-SMT_2_NO_NO-SILK  [SMT-JUMPER_2_NO_NO-SILK]  247.5,82.5 0 top
JP165  JUMPER-SMT_2_NO_NO-SILK  [SMT-JUMPER_2_NO_NO-SILK]  262.5,82.5 0 top
JP166  JUMPER-SMT_2_NO_NO-SILK  [SMT-JUMPER_2_NO_NO-SILK]  277.5,82.5 0 top
JP167  JUMPER-SMT_2_NO_NO-SILK  [SMT-JUMPER_2_NO_NO-SILK]  292.5,82.5 0 top
JP168  JUMPER-SMT_2_NO_NO-SILK  [SMT-JUMPER_2_NO_NO-SILK]  307.5,82.5 0 top
JP169  JUMPER-SMT_2_NO_NO-SILK  [SMT-JUMPER_2_NO_NO-SILK]  7.5,67.5 0 top
JP170  JUMPER-SMT_2_NO_NO-SILK  [SMT-JUMPER_2_NO_NO-SILK]  22.5,67.5 0 top
JP171  JUMPER-SMT_2_NO_NO-SILK  [SMT-JUMPER_2_NO_NO-SILK]  37.5,67.5 0 top
JP172  JUMPER-SMT_2_NO_NO-SILK  [SMT-JUMPER_2_NO_NO-SILK]  52.5,67.5 0 top
JP173  JUMPER-SMT_2_NO_NO-SILK  [SMT-JUMPER_2_NO_NO-SILK]  67.5,67.5 0 top
JP174  JUMPER-SMT_2_NO_NO-SILK  [SMT-JUMPER_2_NO_NO-SILK]  82.5,67.5 0 top
JP175  JUMPER-SMT_2_NO_NO-SILK  [SMT-JUMPER_2_NO_NO-SILK]  97.5,67.5 0 top
JP176  JUMPER-SMT_2_NO_NO-SILK  [SMT-JUMPER_2_NO_NO-SILK]  112.5,67.5 0 top
JP177  JUMPER-SMT_2_NO_NO-SILK  [SMT-JUMPER_2_NO_NO-SILK]  127.5,67.5 0 top
JP178  JUMPER-SMT_2_NO_NO-SILK  [SMT-JUMPER_2_NO_NO-SILK]  142.5,67.5 0 top
JP179  JUMPER-SMT_2_NO_NO-SILK  [SMT-JUMPER_2_NO_NO-SILK]  157.5,67.5 0 top
JP180  JUMPER-SMT_2_NO_NO-SILK  [SMT-JUMPER_2_NO_NO-SILK]  172.5,67.5 0 top
JP181  JUMPER-SMT_2_NO_NO-SILK  [SMT-JUMPER_2_NO_NO-SILK]  187.5,67.5 0 top
JP182  JUMPER-SMT_2_NO_NO-SILK  [SMT-JUMPER_2_NO_NO-SILK]  202.5,67.5 0 top
JP183  JUMPER-SMT_2_NO_NO-SILK  [SMT-JUMPER_2_NO_NO-SILK]  217.5,67.5 0 top
JP184  JUMPER-SMT_2_NO_NO-SILK  [SMT-JUMPER_2_NO_NO-SILK]  232.5,67.5 0 top
JP185  JUMPER-SMT_2_NO_NO-SILK  [SMT-JUMPER_2_NO_NO-SILK]  247.5,67.5 0 top
JP186  JUMPER-SMT_2_NO_NO-SILK  [SMT-JUMPER_2_NO_NO-SILK]  262.5,67.5 0 top
JP187  JUMPER-SMT_2_NO_NO-SILK  [SMT-JUMPER_2_NO_NO-SILK]  277.5,67.5 0 top
JP188  JUMPER-SMT_2_NO_NO-SILK  [SMT-JUMPER_2_NO_NO-SILK]  292.5,67.5 0 top
JP189  JUMPER-SMT_2_NO_NO-SILK  [SMT-JUMPER_2_NO_NO-SILK]  307.5,67.5 0 top
JP190  JUMPER-SMT_2_NO_NO-SILK  [SMT-JUMPER_2_NO_NO-SILK]  7.5,52.5 0 top
JP191  JUMPER-SMT_2_NO_NO-SILK  [SMT-JUMPER_2_NO_NO-SILK]  22.5,52.5 0 top
JP192  JUMPER-SMT_2_NO_NO-SILK  [SMT-JUMPER_2_NO_NO-SILK]  37.5,52.5 0 top
JP193  JUMPER-SMT_2_NO_NO-SILK  [SMT-JUMPER_2_NO_NO-SILK]  52.5,52.5 0 top
JP194  JUMPER-SMT_2_NO_NO-SILK  [SMT-JUMPER_2_NO_NO-SILK]  67.5,52.5 0 top
JP195  JUMPER-SMT_2_NO_NO-SILK  [SMT-JUMPER_2_NO_NO-SILK]  82.5,52.5 0 top
JP196  JUMPER-SMT_2_NO_NO-SILK  [SMT-JUMPER_2_NO_NO-SILK]  97.5,52.5 0 top
JP197  JUMPER-SMT_2_NO_NO-SILK  [SMT-JUMPER_2_NO_NO-SILK]  112.5,52.5 0 top
JP198  JUMPER-SMT_2_NO_NO-SILK  [SMT-JUMPER_2_NO_NO-SILK]  127.5,52.5 0 top
JP199  JUMPER-SMT_2_NO_NO-SILK  [SMT-JUMPER_2_NO_NO-SILK]  142.5,52.5 0 top
JP200  JUMPER-SMT_2_NO_NO-SILK  [SMT-JUMPER_2_NO_NO-SILK]  157.5,52.5 0 top
JP201  JUMPER-SMT_2_NO_NO-SILK  [SMT-JUMPER_2_NO_NO-SILK]  172.5,52.5 0 top
JP202  JUMPER-SMT_2_NO_NO-SILK  [SMT-JUMPER_2_NO_NO-SILK]  187.5,52.5 0 top
JP203  JUMPER-SMT_2_NO_NO-SILK  [SMT-JUMPER_2_NO_NO-SILK]  202.5,52.5 0 top
JP204  JUMPER-SMT_2_NO_NO-SILK  [SMT-JUMPER_2_NO_NO-SILK]  217.5,52.5 0 top
JP205  JUMPER-SMT_2_NO_NO-SILK  [SMT-JUMPER_2_NO_NO-SILK]  232.5,52.5 0 top
JP206  JUMPER-SMT_2_NO_NO-SILK  [SMT-JUMPER_2_NO_NO-SILK]  247.5,52.5 0 top
JP207  JUMPER-SMT_2_NO_NO-SILK  [SMT-JUMPER_2_NO_NO-SILK]  262.5,52.5 0 top
JP208  JUMPER-SMT_2_NO_NO-SILK  [SMT-JUMPER_2_NO_NO-SILK]  277.5,52.5 0 top
JP209  JUMPER-SMT_2_NO_NO-SILK  [SMT-JUMPER_2_NO_NO-SILK]  292.5,52.5 0 top
JP210  JUMPER-SMT_2_NO_NO-SILK  [SMT-JUMPER_2_NO_NO-SILK]  307.5,52.5 0 top
JP212  JUMPER-SMT_2_NO_NO-SILK  [SMT-JUMPER_2_NO_NO-SILK]  22.5,37.5 0 top
JP213  JUMPER-SMT_2_NO_NO-SILK  [SMT-JUMPER_2_NO_NO-SILK]  37.5,37.5 0 top
JP214  JUMPER-SMT_2_NO_NO-SILK  [SMT-JUMPER_2_NO_NO-SILK]  52.5,37.5 0 top
JP215  JUMPER-SMT_2_NO_NO-SILK  [SMT-JUMPER_2_NO_NO-SILK]  67.5,37.5 0 top
JP216  JUMPER-SMT_2_NO_NO-SILK  [SMT-JUMPER_2_NO_NO-SILK]  82.5,37.5 0 top
JP217  JUMPER-SMT_2_NO_NO-SILK  [SMT-JUMPER_2_NO_NO-SILK]  97.5,37.5 0 top
JP218  JUMPER-SMT_2_NO_NO-SILK  [SMT-JUMPER_2_NO_NO-SILK]  112.5,37.5 0 top
JP219  JUMPER-SMT_2_NO_NO-SILK  [SMT-JUMPER_2_NO_NO-SILK]  127.5,37.5 0 top
JP220  JUMPER-SMT_2_NO_NO-SILK  [SMT-JUMPER_2_NO_NO-SILK]  142.5,37.5 0 top
JP221  JUMPER-SMT_2_NO_NO-SILK  [SMT-JUMPER_2_NO_NO-SILK]  157.5,37.5 0 top
JP222  JUMPER-SMT_2_NO_NO-SILK  [SMT-JUMPER_2_NO_NO-SILK]  172.5,37.5 0 top
JP223  JUMPER-SMT_2_NO_NO-SILK  [SMT-JUMPER_2_NO_NO-SILK]  187.5,37.5 0 top
JP224  JUMPER-SMT_2_NO_NO-SILK  [SMT-JUMPER_2_NO_NO-SILK]  202.5,37.5 0 top
JP225  JUMPER-SMT_2_NO_NO-SILK  [SMT-JUMPER_2_NO_NO-SILK]  217.5,37.5 0 top
JP226  JUMPER-SMT_2_NO_NO-SILK  [SMT-JUMPER_2_NO_NO-SILK]  232.5,37.5 0 top
JP227  JUMPER-SMT_2_NO_NO-SILK  [SMT-JUMPER_2_NO_NO-SILK]  247.5,37.5 0 top
JP228  JUMPER-SMT_2_NO_NO-SILK  [SMT-JUMPER_2_NO_NO-SILK]  262.5,37.5 0 top
JP229  JUMPER-SMT_2_NO_NO-SILK  [SMT-JUMPER_2_NO_NO-SILK]  277.5,37.5 0 top
JP230  JUMPER-SMT_2_NO_NO-SILK  [SMT-JUMPER_2_NO_NO-SILK]  292.5,37.5 0 top
JP231  JUMPER-SMT_2_NO_NO-SILK  [SMT-JUMPER_2_NO_NO-SILK]  307.5,37.5 0 top
JP232  JUMPER-SMT_2_NO_NO-SILK  [SMT-JUMPER_2_NO_NO-SILK]  82.5,22.5 0 top
JP233  JUMPER-SMT_2_NO_NO-SILK  [SMT-JUMPER_2_NO_NO-SILK]  97.5,22.5 0 top
JP234  JUMPER-SMT_2_NO_NO-SILK  [SMT-JUMPER_2_NO_NO-SILK]  112.5,22.5 0 top
JP235  JUMPER-SMT_2_NO_NO-SILK  [SMT-JUMPER_2_NO_NO-SILK]  127.5,22.5 0 top
JP236  JUMPER-SMT_2_NO_NO-SILK  [SMT-JUMPER_2_NO_NO-SILK]  142.5,22.5 0 top
JP237  JUMPER-SMT_2_NO_NO-SILK  [SMT-JUMPER_2_NO_NO-SILK]  157.5,22.5 0 top
JP238  JUMPER-SMT_2_NO_NO-SILK  [SMT-JUMPER_2_NO_NO-SILK]  172.5,22.5 0 top
JP239  JUMPER-SMT_2_NO_NO-SILK  [SMT-JUMPER_2_NO_NO-SILK]  187.5,22.5 0 top
JP240  JUMPER-SMT_2_NO_NO-SILK  [SMT-JUMPER_2_NO_NO-SILK]  202.5,22.5 0 top
JP241  JUMPER-SMT_2_NO_NO-SILK  [SMT-JUMPER_2_NO_NO-SILK]  217.5,22.5 0 top
JP242  JUMPER-SMT_2_NO_NO-SILK  [SMT-JUMPER_2_NO_NO-SILK]  232.5,22.5 0 top
JP243  JUMPER-SMT_2_NO_NO-SILK  [SMT-JUMPER_2_NO_NO-SILK]  247.5,22.5 0 top
JP244  JUMPER-SMT_2_NO_NO-SILK  [SMT-JUMPER_2_NO_NO-SILK]  262.5,22.5 0 top
JP245  JUMPER-SMT_2_NO_NO-SILK  [SMT-JUMPER_2_NO_NO-SILK]  277.5,22.5 0 top
JP246  JUMPER-SMT_2_NO_NO-SILK  [SMT-JUMPER_2_NO_NO-SILK]  292.5,22.5 0 top
JP247  JUMPER-SMT_2_NO_NO-SILK  [SMT-JUMPER_2_NO_NO-SILK]  307.5,22.5 0 top
JP248  JUMPER-SMT_2_NO_NO-SILK  [SMT-JUMPER_2_NO_NO-SILK]  82.5,7.5 0 top
JP249  JUMPER-SMT_2_NO_NO-SILK  [SMT-JUMPER_2_NO_NO-SILK]  97.5,7.5 0 top
JP250  JUMPER-SMT_2_NO_NO-SILK  [SMT-JUMPER_2_NO_NO-SILK]  112.5,7.5 0 top
JP251  JUMPER-SMT_2_NO_NO-SILK  [SMT-JUMPER_2_NO_NO-SILK]  127.5,7.5 0 top
JP252  JUMPER-SMT_2_NO_NO-SILK  [SMT-JUMPER_2_NO_NO-SILK]  142.5,7.5 0 top
JP253  JUMPER-SMT_2_NO_NO-SILK  [SMT-JUMPER_2_NO_NO-SILK]  157.5,7.5 0 top
JP254  JUMPER-SMT_2_NO_NO-SILK  [SMT-JUMPER_2_NO_NO-SILK]  172.5,7.5 0 top
JP255  JUMPER-SMT_2_NO_NO-SILK  [SMT-JUMPER_2_NO_NO-SILK]  187.5,7.5 0 top
JP256  JUMPER-SMT_2_NO_NO-SILK  [SMT-JUMPER_2_NO_NO-SILK]  202.5,7.5 0 top
JP257  JUMPER-SMT_2_NO_NO-SILK  [SMT-JUMPER_2_NO_NO-SILK]  217.5,7.5 0 top
JP258  JUMPER-SMT_2_NO_NO-SILK  [SMT-JUMPER_2_NO_NO-SILK]  232.5,7.5 0 top
JP259  JUMPER-SMT_2_NO_NO-SILK  [SMT-JUMPER_2_NO_NO-SILK]  247.5,7.5 0 top
JP260  JUMPER-SMT_2_NO_NO-SILK  [SMT-JUMPER_2_NO_NO-SILK]  262.5,7.5 0 top
JP261  JUMPER-SMT_2_NO_NO-SILK  [SMT-JUMPER_2_NO_NO-SILK]  277.5,7.5 0 top
JP262  JUMPER-SMT_2_NO_NO-SILK  [SMT-JUMPER_2_NO_NO-SILK]  292.5,7.5 0 top
Q2  MBT3904DW1T1  [SC70-6]  30.48,4.45 180 top
R1  1k  [0603]  22.51,1.79 0 top
R2  10k  [0603]  27.94,4.45 270 top
R3  5.1k  [0603]  10.16,15.16 180 top
R4  5.1k  [0603]  10.16,17.7 180 top
R5  100k  [0603]  16.51,33.53 0 top
R6  100k  [0603]  16.51,27.82 0 top
R7  100k  [0603]  16.51,31.63 180 top
R8  100K  [0402]  13.97,1.27 0 top
R9  10k  [0603]  73.17,14.29 180 top
R10  10k  [0603]  73.17,10.48 0 top
R11  100k  [0603]  67.45,16.2 270 top
R12  100k  [0603]  16.51,37.34 0 top
R13  1k  [AXIAL-0.3]  76.48,13.66 90 top
R14  1k  [0603]  13.97,29.73 90 top
R15  1k  [0603]  13.97,35.44 90 top
R16  100  [0603]  20.78,4 0 top
R17  10k  [0603]  30.48,1.91 0 top
R18  10k  [0603]  30.48,6.99 0 top
S1  RESET  [TACTILE_SWITCH_SMD_4.6X2.8MM]  35.56,6.35 180 top
S2  0  [TACTILE_SWITCH_SMD_4.6X2.8MM]  35.56,2.54 0 top
U2  ESP-WROOM-32NARROW  [ESP-WROOM-32-NARROW]  50.8,10.16 0 top
U3  AP2112K-3.3V  [SOT23-5]  13.97,5.08 0 top
U4  CP2102N  [QFN24]  24.13,6.35 0 top
U5  ADMP401  [ADMP401]  70.63,3.5 0 top
U$2  OPA344  [SOT23-5]  73.17,17.47 0 top
U$3  [CEC7B2_1EE547F747C2467BB1A21A2065860725_MV2#JPG]  30,20 0 top